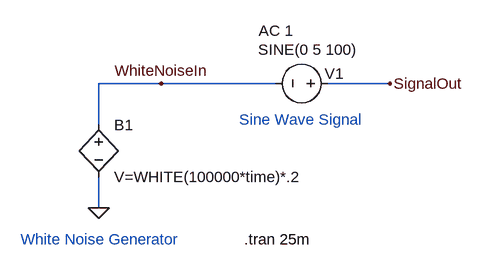
[diagram p0: schematic White_Noise_w_Sinewave.asc]
White_Noise_w_Sinewave.asc, the LTspice schematic file:
Version 4
SHEET 1 2908 1132
WIRE 1056 224 960 224
WIRE 1232 224 1056 224
WIRE 1408 224 1312 224
WIRE 960 288 960 224
WIRE 960 416 960 368
FLAG 960 416 0
FLAG 1056 224 WhiteNoiseIn
FLAG 1408 224 SignalOut
SYMBOL bv 960 272 R0
SYMATTR InstName B1
SYMATTR Value V=WHITE(100000*time)*.2
SYMBOL voltage 1328 224 R90
WINDOW 3 -52 -30 VRight 2
WINDOW 123 -81 69 VRight 2
WINDOW 0 -15 -9 VRight 2
SYMATTR Value SINE(0 5 100)
SYMATTR Value2 AC 1
SYMATTR InstName V1
TEXT 1184 464 Left 2 !.tran 25m
TEXT 1176 280 Left 2 ;Sine Wave Signal
TEXT 840 464 Left 2 ;White Noise Generator

The netlist it stands for:
* White_Noise_w_Sinewave.asc
B1 WhiteNoiseIn 0 V=WHITE(100000*time)*.2
V1 SignalOut WhiteNoiseIn SINE(0 5 100) AC 1
.tran 25m
* Sine Wave Signal
* White Noise Generator
.backanno
.end